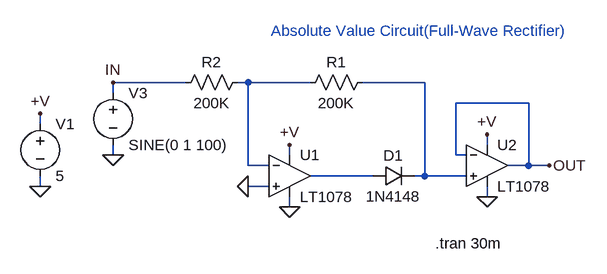
[diagram p0: schematic 1078.asc]
1078.asc, the LTspice schematic file:
Version 4
SHEET 1 896 680
WIRE 32 96 -80 96
WIRE 128 96 112 96
WIRE 224 96 128 96
WIRE 400 96 304 96
WIRE -80 112 -80 96
WIRE 560 128 448 128
WIRE -192 160 -192 144
WIRE 496 192 496 176
WIRE -80 208 -80 192
WIRE 192 208 192 192
WIRE 448 208 448 128
WIRE 464 208 448 208
WIRE 128 224 128 96
WIRE 160 224 128 224
WIRE 560 224 560 128
WIRE 560 224 528 224
WIRE 592 224 560 224
WIRE 320 240 224 240
WIRE 400 240 400 96
WIRE 400 240 384 240
WIRE 464 240 400 240
WIRE -192 256 -192 240
WIRE 160 256 128 256
WIRE 496 272 496 256
WIRE 192 288 192 272
FLAG -192 256 0
FLAG 192 192 +V
FLAG -192 144 +V
FLAG -80 208 0
FLAG 192 288 0
FLAG 496 176 +V
FLAG 496 272 0
FLAG -80 96 IN
FLAG 592 224 OUT
FLAG 128 256 0
SYMBOL voltage -192 144 R0
SYMATTR InstName V1
SYMATTR Value 5
SYMBOL res 320 80 R90
WINDOW 0 0 56 VBottom 2
WINDOW 3 32 56 VTop 2
SYMATTR InstName R1
SYMATTR Value 200K
SYMBOL res 128 80 R90
WINDOW 0 0 56 VBottom 2
WINDOW 3 32 56 VTop 2
SYMATTR InstName R2
SYMATTR Value 200K
SYMBOL voltage -80 96 R0
SYMATTR InstName V3
SYMATTR Value SINE(0 1 100)
SYMBOL opamps\\LT1078 192 176 R0
SYMATTR InstName U1
SYMBOL diode 320 256 R270
WINDOW 0 32 32 VTop 2
WINDOW 3 0 32 VBottom 2
SYMATTR InstName D1
SYMATTR Value 1N4148
SYMBOL opamps\\LT1078 496 160 R0
SYMATTR InstName U2
TEXT 416 344 Left 2 !.tran 30m
TEXT 392 32 Bottom 2 ;Absolute Value Circuit(Full-Wave Rectifier)

The netlist it stands for:
* 1078.asc
V1 +V 0 5
R1 N002 N001 200K
R2 N001 IN 200K
V3 IN 0 SINE(0 1 100)
XU1 0 N001 +V 0 N003 LT1078  ; pins In+ In- V+ V- OUT
D1 N003 N002 1N4148
XU2 N002 OUT +V 0 OUT LT1078  ; pins In+ In- V+ V- OUT
.model D D
.lib standard.dio
.tran 30m
* Absolute Value Circuit(Full-Wave Rectifier)
.backanno
.end